# EAGLE design Power PCB_v3 (EAGLE 9.7.0)
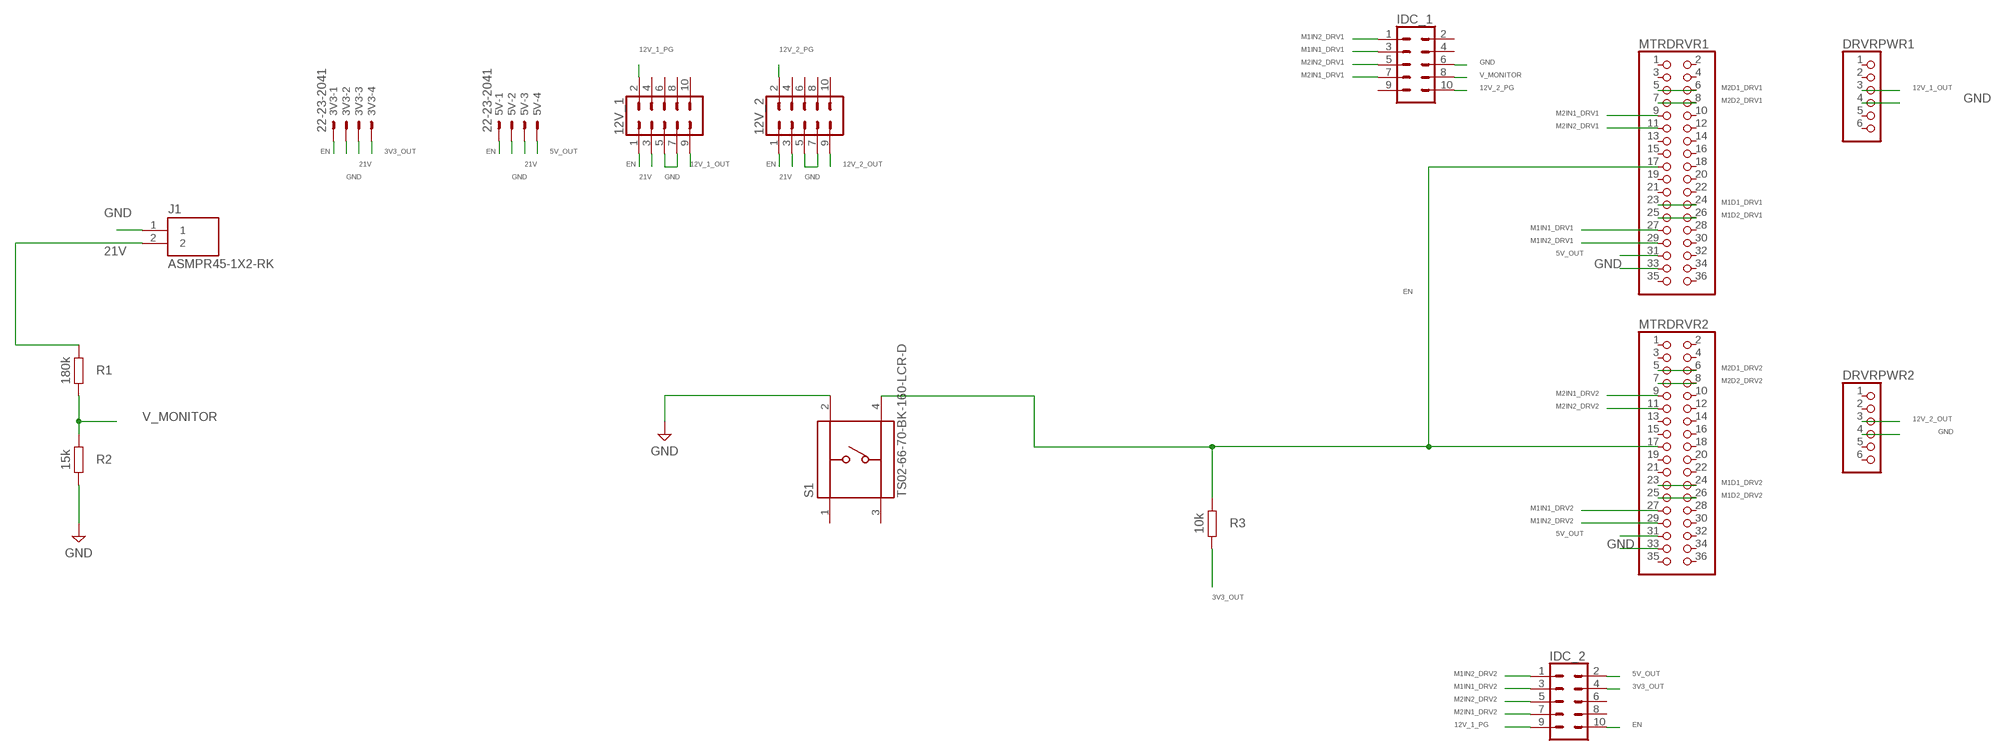
[diagram p0: schematic, sheet 1]

## Parts
3V3  22-23-2041  [22-23-2041]
5V  22-23-2041  [22-23-2041]
12V_1  CONN_05X2PTH  [2X5]
12V_2  CONN_05X2PTH  [2X5]
DRVRPWR1  PINHD-1X6-3.5MM  [1X06-3.5MM]
DRVRPWR2  PINHD-1X6-3.5MM  [1X06-3.5MM]
IDC_1  CONN_05X2PTH  [2X5]
IDC_2  CONN_05X2PTH  [2X5]
J1  ASMPR45-1X2-RK  [APP_ASMPR45-1X2-RK]
MTRDRVR1  PINHD-2X18  [2X18]
MTRDRVR2  PINHD-2X18  [2X18]
R1  180k  R_CHIP-2512(6332-METRIC)  [RESC6332X71]
R2  15k  R_CHIP-2512(6332-METRIC)  [RESC6332X71]
R3  10k  R_CHIP-2512(6332-METRIC)  [RESC6332X71]
S1  TS02-66-70-BK-160-LCR-D  [SW_TS02-66-70-BK-160-LCR-D]

## Nets
3V3_OUT: 3V3.4 IDC_2.4 R3.2
5V_OUT: 5V.4 IDC_2.2 MTRDRVR1.31 MTRDRVR2.31
12V_1_OUT: 12V_1.9 DRVRPWR1.3
12V_1_PG: 12V_1.2 IDC_2.9
12V_2_OUT: 12V_2.9 DRVRPWR2.3
12V_2_PG: 12V_2.2 IDC_1.10
21V: 3V3.3 5V.3 12V_1.3 12V_2.3 J1.2 R1.1
EN: 3V3.1 5V.1 12V_1.1 12V_2.1 IDC_2.10 MTRDRVR1.17 MTRDRVR2.17 R3.1 S1.4
GND: 3V3.2 5V.2 12V_1.5 12V_1.7 12V_2.5 12V_2.7 DRVRPWR1.4 DRVRPWR2.4 IDC_1.6 J1.1 MTRDRVR1.33 MTRDRVR2.33 R2.2 S1.2
M1D1_DRV1: MTRDRVR1.23 MTRDRVR1.24
M1D1_DRV2: MTRDRVR2.23 MTRDRVR2.24
M1D2_DRV1: MTRDRVR1.25 MTRDRVR1.26
M1D2_DRV2: MTRDRVR2.25 MTRDRVR2.26
M1IN1_DRV1: IDC_1.3 MTRDRVR1.27
M1IN1_DRV2: IDC_2.3 MTRDRVR2.27
M1IN2_DRV1: IDC_1.1 MTRDRVR1.29
M1IN2_DRV2: IDC_2.1 MTRDRVR2.29
M2D1_DRV1: MTRDRVR1.5 MTRDRVR1.6
M2D1_DRV2: MTRDRVR2.5 MTRDRVR2.6
M2D2_DRV1: MTRDRVR1.7 MTRDRVR1.8
M2D2_DRV2: MTRDRVR2.7 MTRDRVR2.8
M2IN1_DRV1: IDC_1.7 MTRDRVR1.9
M2IN1_DRV2: IDC_2.7 MTRDRVR2.9
M2IN2_DRV1: IDC_1.5 MTRDRVR1.11
M2IN2_DRV2: IDC_2.5 MTRDRVR2.11
V_MONITOR: IDC_1.8 R1.2 R2.1
Unconnected: 12V_1.4 12V_1.6 12V_1.8 12V_1.10 12V_2.4 12V_2.6 12V_2.8 12V_2.10 DRVRPWR1.1 DRVRPWR1.2 DRVRPWR1.5 DRVRPWR1.6 DRVRPWR2.1 DRVRPWR2.2 DRVRPWR2.5 DRVRPWR2.6 IDC_1.2 IDC_1.4 IDC_1.9 IDC_2.6 IDC_2.8 MTRDRVR1.1 MTRDRVR1.2 MTRDRVR1.3 MTRDRVR1.4 MTRDRVR1.10 MTRDRVR1.12 MTRDRVR1.13 MTRDRVR1.14 MTRDRVR1.15 MTRDRVR1.16 MTRDRVR1.18 MTRDRVR1.19 MTRDRVR1.20 MTRDRVR1.21 MTRDRVR1.22 MTRDRVR1.28 MTRDRVR1.30 MTRDRVR1.32 MTRDRVR1.34 MTRDRVR1.35 MTRDRVR1.36 MTRDRVR2.1 MTRDRVR2.2 MTRDRVR2.3 MTRDRVR2.4 MTRDRVR2.10 MTRDRVR2.12 MTRDRVR2.13 MTRDRVR2.14 MTRDRVR2.15 MTRDRVR2.16 MTRDRVR2.18 MTRDRVR2.19 MTRDRVR2.20 MTRDRVR2.21 MTRDRVR2.22 MTRDRVR2.28 MTRDRVR2.30 MTRDRVR2.32 MTRDRVR2.34 MTRDRVR2.35 MTRDRVR2.36 S1.1 S1.3

## Library data of the parts
3V3 5V = con-molex:22-23-2041: .100" (2.54mm) Center Header - 4 Pin; MF: MOLEX; MPN: 22-23-2041; OC_FARNELL: 1462920; OC_NEWARK: 38C0355
12V_1 12V_2 IDC_1 IDC_2 = SparkFun-Connectors:CONN_05X2: Multi connection point. Often used as Generic Header-pin footprint for 0.1 inch spaced/style header connections For AVR SPI programming port, see special device with nice symbol: "AVR_SPI_PROG_5x2.dev" You can populate with any combo of single row headers, but if you'd like an exact match, check these: 2x5 AVR ICSP Male Header <https://www.sparkfun.com/products/778> (PRT-00778) 2x5 Pin Shrouded Header <https://www.sparkfun.com/products/8506> (PRT-08506) On any of the 0.1 inch spaced packages, you can populate with these: Break Away Headers - Straight <https://www.sparkfun.com/products/116> (PRT-00116) Break Away Male Headers - Right Angle <https://www.sparkfun.com/products/553> (PRT-00553) Female Headers <https://www.sparkfun.com/products/115> (PRT-00115) Break Away Headers - Machine Pin <https://www.sparkfun.com/products/117> (PRT-00117) Break Away Female Headers - Swiss Machine Pin <https://www.sparkfun.com/products/743> (PRT-00743) Special note: the shrouded connector mates well with our 5x2 ribbon cables: 2x5 Pin IDC Ribbon Cable <https://www.sparkfun.com/products/8535> (PRT-08535); PROD_ID: CONN-08499; SF_ID: PRT-0778
DRVRPWR1 DRVRPWR2 = adafruit:PINHD-1X6: PIN HEADER
J1 = Anderson Connector:ASMPR45-1X2-RK; MANUFACTURER: APP; MAXIMUM_PACKAGE_HEIGHT: 8.4mm; PARTREV: N/A; STANDARD: Manufacturer Recommendations
MTRDRVR1 MTRDRVR2 = pinhead:PINHD-2X18: PIN HEADER
R1-R3 = Resistor_2512_extendedPads:R: Resistor Fixed - Generic; CATEGORY: Resistors; DESCRIPTION: Chip Resistor 6.30 X 3.20 X 0.71 mm body 2512(6332-METRIC) Package; PACKAGE_SIZE: 2512; PACKAGE_TYPE: SMD
S1 = Pushbutton Switch (4 pin):TS02-66-70-BK-160-LCR-D; MANUFACTURER: CUI Devices; PARTREV: 1.0; STANDARD: Manufacturer Recommendations

## Board
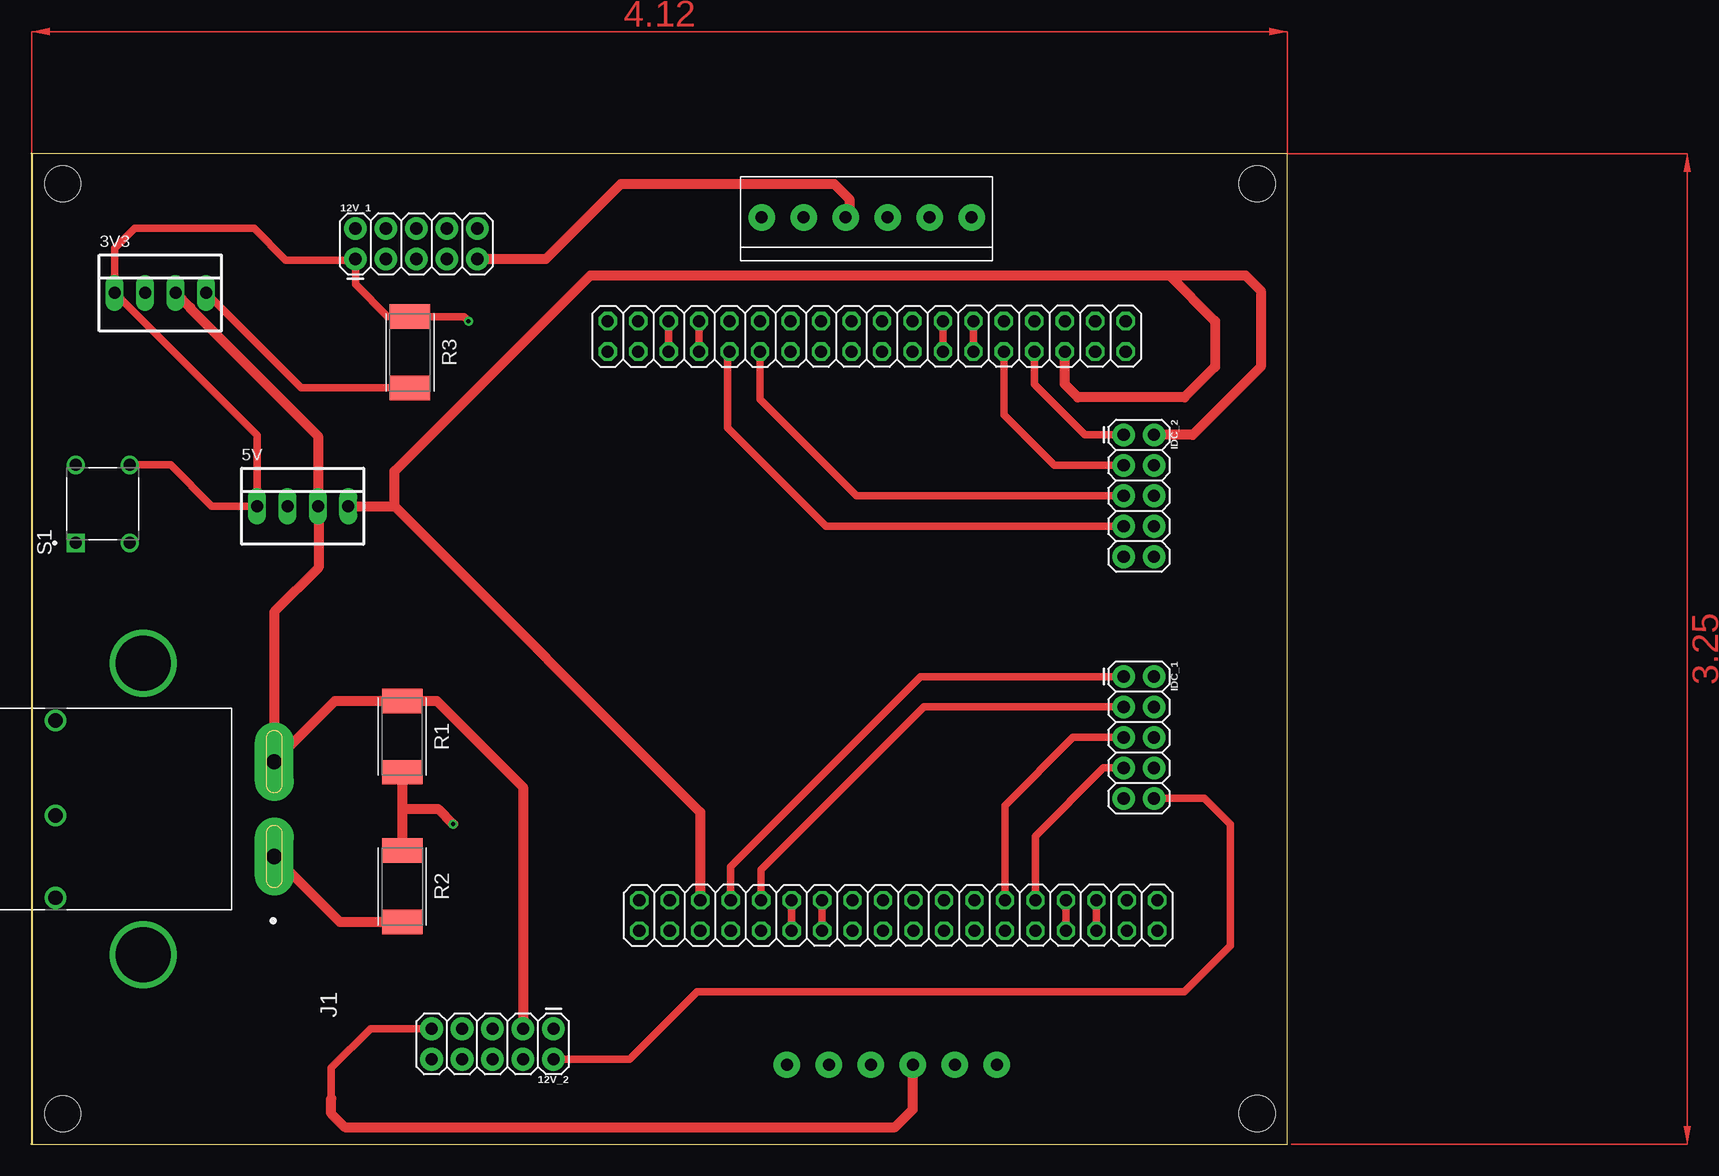
[diagram p1: board, top side]
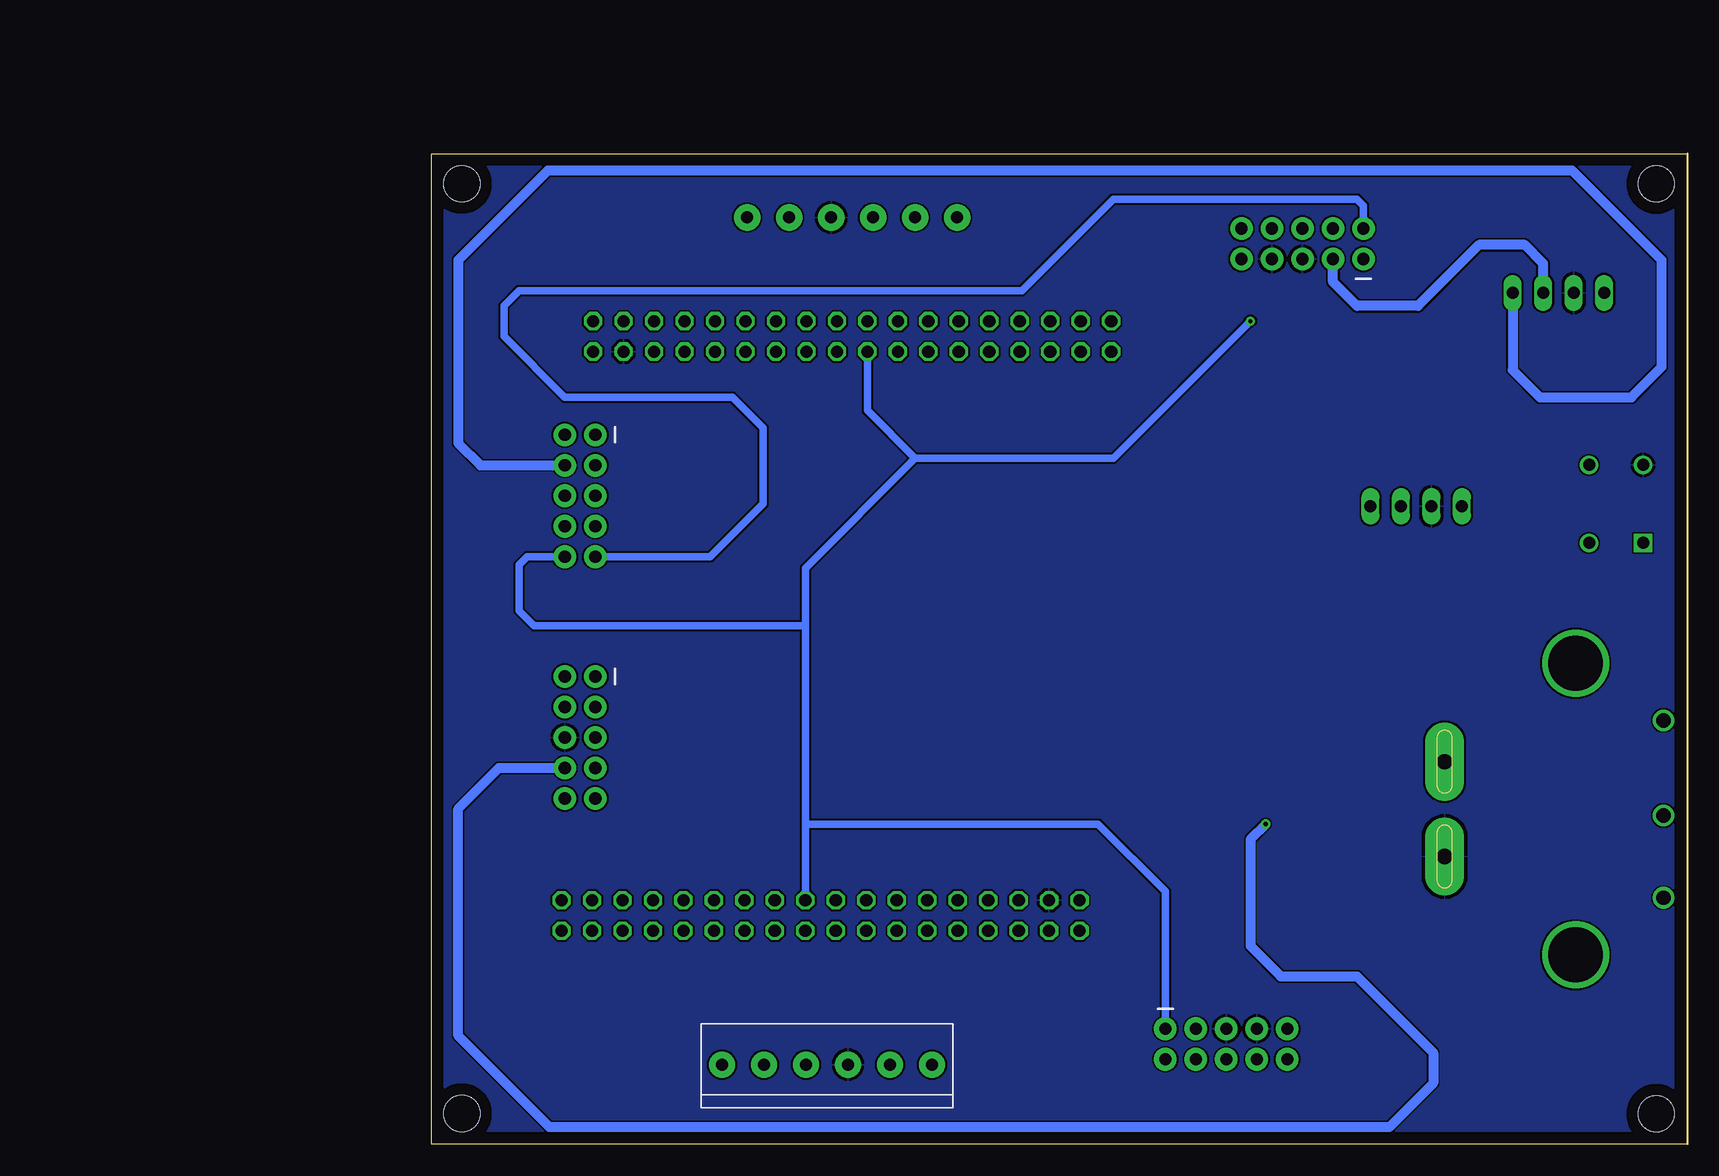
[diagram p2: board, bottom side, seen from below]

Size 104.67 x 82.54 mm. Coordinates in mm from the lower left corner, seen from the top.
Outline: 0,0 104.67,0 104.67,82.54 0,82.54 0,0
Copper layers (1*16): Top / Bottom
Stack-up Default Layer Stack: Top User Defined 0.035mm / Dielectric-1 User Defined 1.5mm / Bottom User Defined 0.035mm
Design rules: minimum copper width 6mil, minimum drill size 0.35mm, copper clearance wire_polygon to wire_polygon 6mil, copper clearance wire_polygon to pad_smd 6mil, copper clearance wire_polygon to via 6mil, copper clearance pad_smd to pad_smd 6mil, copper clearance pad_smd to via 6mil, copper clearance via to via 6mil, copper clearance smd to pad (same net) 6mil, copper clearance smd to via (same net) 6mil, copper clearance smd to smd (same net) 6mil, dimension clearance 40mil, via restrict clearance 0mil, restrict clearance 0mil, drill distance 6mil, keepout clearance 0mil
Holes 3 mm at 102.15,80.02 2.59,80.02 2.59,2.52 102.15,2.55

### Footprints (pad centres in the part's own frame; a part is rotated, then mirrored left to right if it is on the bottom)
22-23-2041 = drill 1 long: 1 -3.81,0; 2 -1.27,0; 3 1.27,0; 4 3.81,0
2X5 = drill 1.016 pad 1.88: 1 0,0; 2 0,2.54; 3 2.54,0; 4 2.54,2.54; 5 5.08,0; 6 5.08,2.54; 7 7.62,0; 8 7.62,2.54; 9 10.16,0; 10 10.16,2.54
1X06-3.5MM = drill 1 pad 2.184: 1 -8.75,0; 2 -5.25,0; 3 -1.75,0; 4 1.75,0; 5 5.25,0; 6 8.75,0
APP_ASMPR45-1X2-RK = drill 1.27 pad 3.27 long: 1 0,0; 2 7.9,0 | drill 4.57: P1 -8.205,10.92; P2 16.105,10.92 | drill 1.2: P3 -3.44,18.24; P4 11.34,18.24; P5 3.42,18.24
2X18 = drill 1.016 octagon: 1 -21.59,-1.27; 2 -21.59,1.27; 3 -19.05,-1.27; 4 -19.05,1.27; 5 -16.51,-1.27; 6 -16.51,1.27; 7 -13.97,-1.27; 8 -13.97,1.27; 9 -11.43,-1.27; 10 -11.43,1.27; 11 -8.89,-1.27; 12 -8.89,1.27; 13 -6.35,-1.27; 14 -6.35,1.27; 15 -3.81,-1.27; 16 -3.81,1.27; 17 -1.27,-1.27; 18 -1.27,1.27; 19 1.27,-1.27; 20 1.27,1.27; 21 3.81,-1.27; 22 3.81,1.27; 23 6.35,-1.27; 24 6.35,1.27; 25 8.89,-1.27; 26 8.89,1.27; 27 11.43,-1.27; 28 11.43,1.27; 29 13.97,-1.27; 30 13.97,1.27; 31 16.51,-1.27; 32 16.51,1.27; 33 19.05,-1.27; 34 19.05,1.27; 35 21.59,-1.27; 36 21.59,1.27
RESC6332X71 = smd 2.032 x 3.37: 1 -2.97,0; 2 2.97,0
SW_TS02-66-70-BK-160-LCR-D = drill 1 square: 1 -3.25,2.25 | drill 1: 2 3.25,2.25; 3 -3.25,-2.25; 4 3.25,-2.25

### Placement (x,y rotation side)
3V3  10.74,70.93 0 top
5V  22.6,53.15 0 top
12V_1  27,73.76 0 top
12V_2  43.51,9.61 180 top
DRVRPWR1  69.62,77.22 0 top
DRVRPWR2  71.71,6.62 0 bottom
IDC_1  91.03,38.96 270 top
IDC_2  91.03,59.11 270 top
J1  20.23,23.97 90 top
MTRDRVR1  72.25,19.05 180 top
MTRDRVR2  69.62,67.31 0 top
R1  30.9,33.96 270 top
R2  30.91,21.48 270 top
R3  31.54,65.98 270 top
S1  5.94,53.34 90 top

### Tracks (layer width: path | path; a pad name or v marks a point on that pad's centre or on a via)
3V3_OUT
  Top 0.61: 3V3.4 22.47,63.01 R3.2
  Bottom 0.813: 3V3.4 14.55,64.49 12.29,62.23 4.67,62.23 2.13,64.77 2.13,73.66 9.59,81.12 95,81.12 102.46,73.66 102.46,58.42 100.61,56.57 IDC_2.4
5V_OUT
  Top 0.813: 5V.4 30.26,53.15 | 30.26,53.15 55.74,27.67 MTRDRVR1.31 | 30.26,53.15 30.26,56.07 46.58,72.39 94.84,72.39 | 94.84,72.39 98.65,68.58 98.65,64.77 96.11,62.23 87.22,62.23 86.13,63.32 MTRDRVR2.31 | 94.84,72.39 101.19,72.39 102.46,71.12 102.46,64.77 96.8,59.11 IDC_2.2
12V_1_OUT
  Top 0.813: 12V_1.9 42.87,73.76 49.12,80.01 66.9,80.01 68.17,78.74 68.17,77.52 DRVRPWR1.3
12V_1_PG
  Bottom 0.61: 12V_1.2 27,78.21 27.53,78.74 47.85,78.74 55.47,71.12 97.38,71.12 98.65,69.85 98.65,67.31 93.57,62.23 79.6,62.23 77.06,59.69 77.06,53.34 81.45,48.95 IDC_2.9
12V_2_OUT
  Top 0.61: 24.99,3.81 24.99,6.35 28.25,9.61 12V_2.9
  Top 0.813: 24.99,3.81 24.99,2.54 26.11,1.42 71.98,1.42 73.46,2.9 DRVRPWR2.3
12V_2_PG
  Top 0.61: 12V_2.2 49.84,7.07 55.47,12.7 96.11,12.7 99.92,16.51 99.92,26.67 97.79,28.8 IDC_1.10
21V
  Top 0.813: 3V3.3 13.24,69.7 13.24,69.63 23.87,59 5V.3 23.91,53.11 23.91,48.04 20.23,44.36 J1.2 25.29,36.93 R1.1 33.78,36.93 40.97,29.74 12V_2.3
  Bottom 0.813: 3V3.3 12.01,73.38 13.56,74.93 17.37,74.93 22.45,69.85 27.53,69.85 29.54,71.86 12V_1.3
EN  (via drill 0.35)
  Top 0.61: S1.4 11.58,56.59 15.02,53.15 5V.1 18.79,59.07 3V3.1 6.93,74.65 8.58,76.3 18.54,76.3 21.18,73.66 26.9,73.66 12V_1.1 27,71.65 29.7,68.95 R3.1 36.05,68.95 v36.42,68.58
  Bottom 0.61: v36.42,68.58 47.85,57.15 64.36,57.15 | 64.36,57.15 68.35,61.14 MTRDRVR2.17 | 64.36,57.15 73.52,47.99 73.52,43.18 | 73.52,26.67 73.52,43.18 | 73.52,26.67 MTRDRVR1.17 | 73.52,26.67 49.12,26.67 43.51,21.06 12V_2.1 | 73.52,43.18 96.11,43.18 97.38,44.45 97.38,48.26 96.69,48.95 IDC_2.10
GND
  Top 0.813: J1.1 25.69,18.51 R2.2
  pour Bottom: -1.68,85.09 110.08,85.09 110.08,-2.54 -1.68,-2.54
M1D1_DRV1
  Top 0.61: MTRDRVR1.23 MTRDRVR1.24
M1D1_DRV2
  Top 0.61: MTRDRVR2.24 MTRDRVR2.23
M1D2_DRV1
  Top 0.61: MTRDRVR1.25 MTRDRVR1.26
M1D2_DRV2
  Top 0.61: MTRDRVR2.26 MTRDRVR2.25
M1IN1_DRV1
  Top 0.61: MTRDRVR1.27 60.82,22.86 74.38,36.42 IDC_1.3
M1IN1_DRV2
  Top 0.61: MTRDRVR2.27 81.05,60.78 85.26,56.57 IDC_2.3
M1IN2_DRV1
  Top 0.61: MTRDRVR1.29 58.28,23.13 74.11,38.96 IDC_1.1
M1IN2_DRV2
  Top 0.61: MTRDRVR2.29 83.59,63.32 87.8,59.11 IDC_2.1
M2D1_DRV1
  Top 0.61: MTRDRVR1.5 MTRDRVR1.6
M2D1_DRV2
  Top 0.61: MTRDRVR2.6 MTRDRVR2.5
M2D2_DRV1
  Top 0.61: MTRDRVR1.7 MTRDRVR1.8
M2D2_DRV2
  Top 0.61: MTRDRVR2.8 MTRDRVR2.7
M2IN1_DRV1
  Top 0.61: MTRDRVR1.9 83.68,25.67 89.35,31.34 IDC_1.7
M2IN1_DRV2
  Top 0.61: MTRDRVR2.9 58.01,65.86 58.01,59.69 66.21,51.49 IDC_2.7
M2IN2_DRV1
  Top 0.61: MTRDRVR1.11 81.14,28.21 86.81,33.88 IDC_1.5
M2IN2_DRV2
  Top 0.61: MTRDRVR2.11 60.73,62.05 68.75,54.03 IDC_2.5
V_MONITOR  (via drill 0.35)
  Top 0.813: R1.2 30.9,27.94 | 30.9,27.94 R2.1 | 30.9,27.94 33.88,27.94 v35.15,26.67
  Bottom 0.813: v35.15,26.67 36.42,25.4 36.42,16.51 33.88,13.97 27.53,13.97 21.18,7.62 21.18,5.08 24.84,1.42 94.84,1.42 102.46,9.04 102.46,27.94 99.06,31.34 IDC_1.8
(copper drawn outside any net)
  shapes: Top area x2